# EAGLE schematic west-comms-hardware (EAGLE 9.6.2)
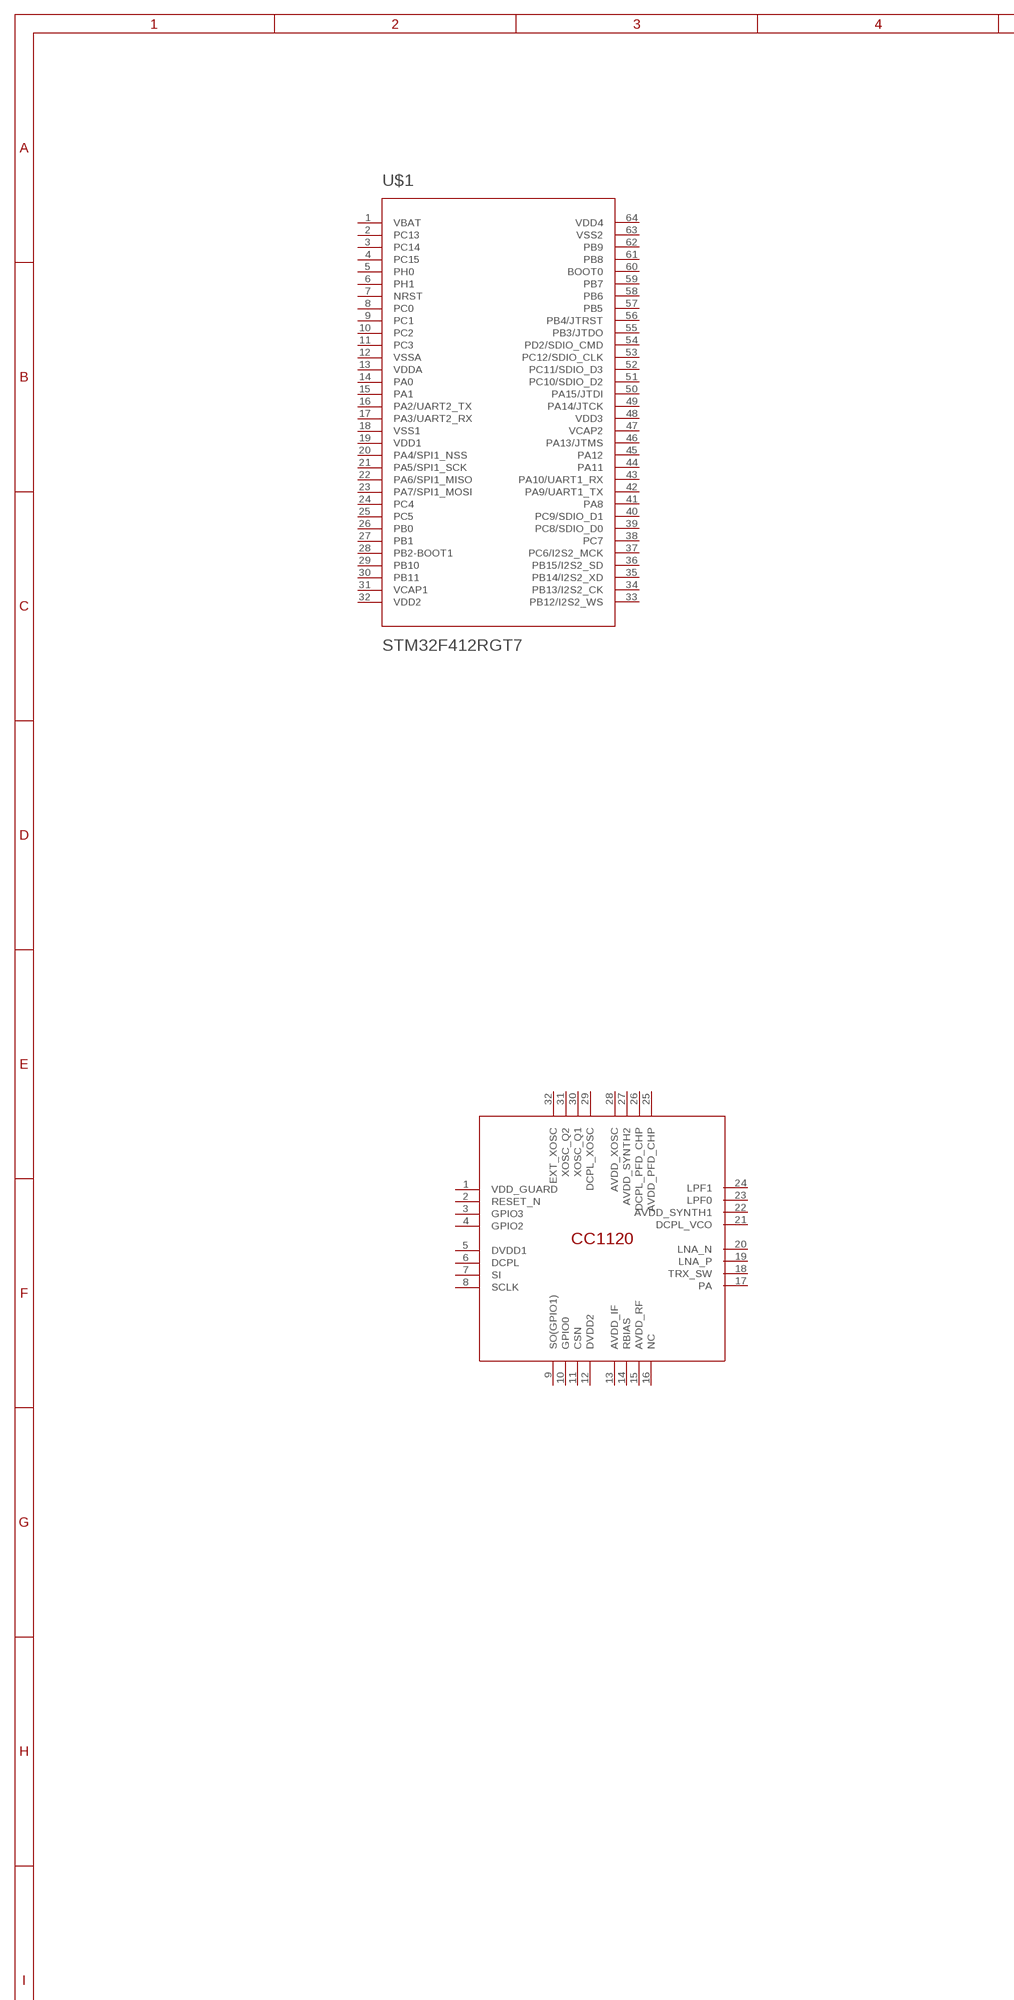
[diagram p0: schematic, sheet 1, part 1 of 2]
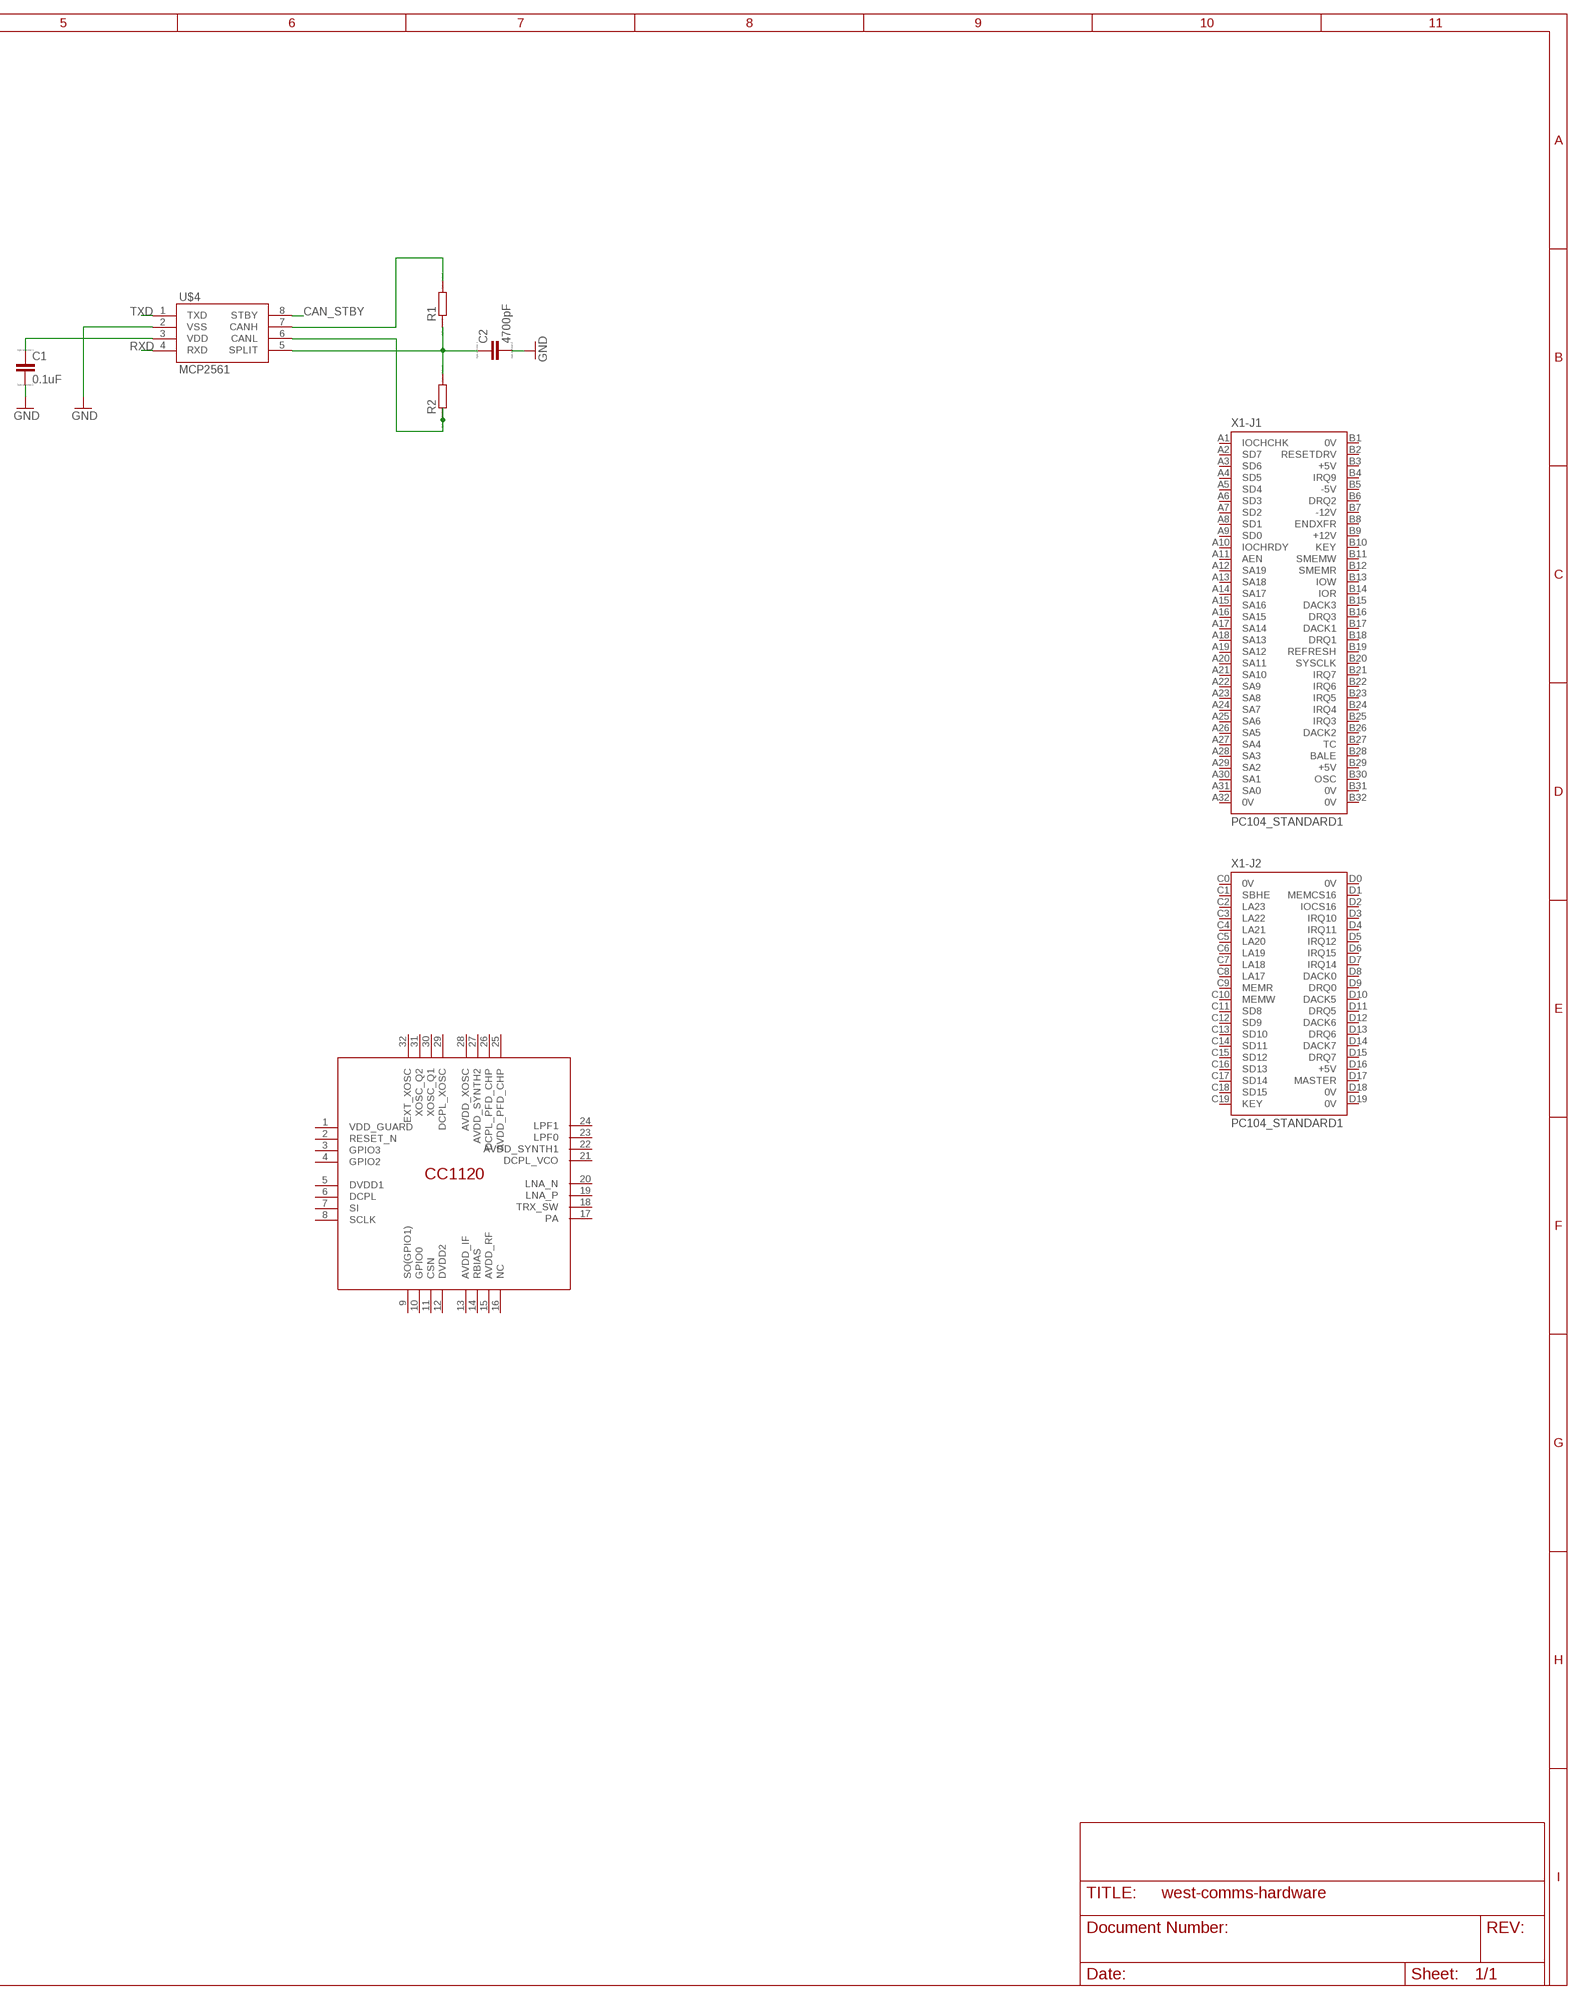
[diagram p1: schematic, sheet 1, part 2 of 2]

## Parts
C1  0.1uF  CC0603  [C0603]
C2  4700pF  CC0603  [C0603]
R1  RR0603  [R0603]
R2  RR0603  [R0603]
U$1  STM32F412RGT7  STM32F405RG  [TQFP64]
U$2  CC1120  [VQFN]
U$3  CC1120  [VQFN]
U$4  MCP2561  [SO08]
X1  PC104_STANDARD1  [PC104-STANDARD]

## Nets
CAN_STBY: U$4.8(STBY)
CANH: R1.2 U$4.7(CANH)
CANL: R2.1 U$4.6(CANL)
GND: C1.2 C2.2 U$4.2(VSS)
N$1: C2.1 R1.1 R2.2 U$4.5(SPLIT)
N$5: C1.1 U$4.3(VDD)
RXD: U$4.4(RXD)
TXD: U$4.1(TXD)
Unconnected: U$1.1(VBAT) U$1.2(PC13) U$1.3(PC14) U$1.4(PC15) U$1.5(PH0) U$1.6(PH1) U$1.7(NRST) U$1.8(PC0) U$1.9(PC1) U$1.10(PC2) U$1.11(PC3) U$1.12(VSSA) U$1.13(VDDA) U$1.14(PA0) U$1.15(PA1) U$1.16(PA2/UART2_TX) U$1.17(PA3/UART2_RX) U$1.18(VSS1) U$1.19(VDD1) U$1.20(PA4/SPI1_NSS) U$1.21(PA5/SPI1_SCK) U$1.22(PA6/SPI1_MISO) U$1.23(PA7/SPI1_MOSI) U$1.24(PC4) U$1.25(PC5) U$1.26(PB0) U$1.27(PB1) U$1.28(PB2-BOOT1) U$1.29(PB10) U$1.30(PB11) U$1.31(VCAP1) U$1.32(VDD2) U$1.33(PB12/I2S2_WS) U$1.34(PB13/I2S2_CK) U$1.35(PB14/I2S2_XD) U$1.36(PB15/I2S2_SD) U$1.37(PC6/I2S2_MCK) U$1.38(PC7) U$1.39(PC8/SDIO_D0) U$1.40(PC9/SDIO_D1) U$1.41(PA8) U$1.42(PA9/UART1_TX) U$1.43(PA10/UART1_RX) U$1.44(PA11) U$1.45(PA12) U$1.46(PA13/JTMS) U$1.47(VCAP2) U$1.48(VDD3) U$1.49(PA14/JTCK) U$1.50(PA15/JTDI) U$1.51(PC10/SDIO_D2) U$1.52(PC11/SDIO_D3) U$1.53(PC12/SDIO_CLK) U$1.54(PD2/SDIO_CMD) U$1.55(PB3/JTDO) U$1.56(PB4/JTRST) U$1.57(PB5) U$1.58(PB6) U$1.59(PB7) U$1.60(BOOT0) U$1.61(PB8) U$1.62(PB9) U$1.63(VSS2) U$1.64(VDD4) U$2.1(VDD_GUARD) U$2.2(RESET_N) U$2.3(GPIO3) U$2.4(GPIO2) U$2.5(DVDD1) U$2.6(DCPL) U$2.7(SI) U$2.8(SCLK) U$2.9(SO(GPIO1)) U$2.10(GPIO0) U$2.11(CSN) U$2.12(DVDD2) U$2.13(AVDD_IF) U$2.14(RBIAS) U$2.15(AVDD_RF) U$2.16(NC) U$2.17(PA) U$2.18(TRX_SW) U$2.19(LNA_P) U$2.20(LNA_N) U$2.21(DCPL_VCO) U$2.22(AVDD_SYNTH1) U$2.23(LPF0) U$2.24(LPF1) U$2.25(AVDD_PFD_CHP) U$2.26(DCPL_PFD_CHP) U$2.27(AVDD_SYNTH2) U$2.28(AVDD_XOSC) U$2.29(DCPL_XOSC) U$2.30(XOSC_Q1) U$2.31(XOSC_Q2) U$2.32(EXT_XOSC) U$3.1(VDD_GUARD) U$3.2(RESET_N) U$3.3(GPIO3) U$3.4(GPIO2) U$3.5(DVDD1) U$3.6(DCPL) U$3.7(SI) U$3.8(SCLK) U$3.9(SO(GPIO1)) U$3.10(GPIO0) U$3.11(CSN) U$3.12(DVDD2) U$3.13(AVDD_IF) U$3.14(RBIAS) U$3.15(AVDD_RF) U$3.16(NC) U$3.17(PA) U$3.18(TRX_SW) U$3.19(LNA_P) U$3.20(LNA_N) U$3.21(DCPL_VCO) U$3.22(AVDD_SYNTH1) U$3.23(LPF0) U$3.24(LPF1) U$3.25(AVDD_PFD_CHP) U$3.26(DCPL_PFD_CHP) U$3.27(AVDD_SYNTH2) U$3.28(AVDD_XOSC) U$3.29(DCPL_XOSC) U$3.30(XOSC_Q1) U$3.31(XOSC_Q2) U$3.32(EXT_XOSC) X1.A1(-J1:IOCHCHK) X1.A2(-J1:SD7) X1.A3(-J1:SD6) X1.A4(-J1:SD5) X1.A5(-J1:SD4) X1.A6(-J1:SD3) X1.A7(-J1:SD2) X1.A8(-J1:SD1) X1.A9(-J1:SD0) X1.A10(-J1:IOCHRDY) X1.A11(-J1:AEN) X1.A12(-J1:SA19) X1.A13(-J1:SA18) X1.A14(-J1:SA17) X1.A15(-J1:SA16) X1.A16(-J1:SA15) X1.A17(-J1:SA14) X1.A18(-J1:SA13) X1.A19(-J1:SA12) X1.A20(-J1:SA11) X1.A21(-J1:SA10) X1.A22(-J1:SA9) X1.A23(-J1:SA8) X1.A24(-J1:SA7) X1.A25(-J1:SA6) X1.A26(-J1:SA5) X1.A27(-J1:SA4) X1.A28(-J1:SA3) X1.A29(-J1:SA2) X1.A30(-J1:SA1) X1.A31(-J1:SA0) X1.A32(-J1:0V) X1.B1(-J1:0V) X1.B2(-J1:RESETDRV) X1.B3(-J1:+5V) X1.B4(-J1:IRQ9) X1.B5(-J1:-5V) X1.B6(-J1:DRQ2) X1.B7(-J1:-12V) X1.B8(-J1:ENDXFR) X1.B9(-J1:+12V) X1.B10(-J1:KEY) X1.B11(-J1:SMEMW) X1.B12(-J1:SMEMR) X1.B13(-J1:IOW) X1.B14(-J1:IOR) X1.B15(-J1:DACK3) X1.B16(-J1:DRQ3) X1.B17(-J1:DACK1) X1.B18(-J1:DRQ1) X1.B19(-J1:REFRESH) X1.B20(-J1:SYSCLK) X1.B21(-J1:IRQ7) X1.B22(-J1:IRQ6) X1.B23(-J1:IRQ5) X1.B24(-J1:IRQ4) X1.B25(-J1:IRQ3) X1.B26(-J1:DACK2) X1.B27(-J1:TC) X1.B28(-J1:BALE) X1.B29(-J1:+5V) X1.B30(-J1:OSC) X1.B31(-J1:0V) X1.B32(-J1:0V) X1.C0(-J2:0V) X1.C1(-J2:SBHE) X1.C2(-J2:LA23) X1.C3(-J2:LA22) X1.C4(-J2:LA21) X1.C5(-J2:LA20) X1.C6(-J2:LA19) X1.C7(-J2:LA18) X1.C8(-J2:LA17) X1.C9(-J2:MEMR) X1.C10(-J2:MEMW) X1.C11(-J2:SD8) X1.C12(-J2:SD9) X1.C13(-J2:SD10) X1.C14(-J2:SD11) X1.C15(-J2:SD12) X1.C16(-J2:SD13) X1.C17(-J2:SD14) X1.C18(-J2:SD15) X1.C19(-J2:KEY) X1.D0(-J2:0V) X1.D1(-J2:MEMCS16) X1.D2(-J2:IOCS16) X1.D3(-J2:IRQ10) X1.D4(-J2:IRQ11) X1.D5(-J2:IRQ12) X1.D6(-J2:IRQ15) X1.D7(-J2:IRQ14) X1.D8(-J2:DACK0) X1.D9(-J2:DRQ0) X1.D10(-J2:DACK5) X1.D11(-J2:DRQ5) X1.D12(-J2:DACK6) X1.D13(-J2:DRQ6) X1.D14(-J2:DACK7) X1.D15(-J2:DRQ7) X1.D16(-J2:+5V) X1.D17(-J2:MASTER) X1.D18(-J2:0V) X1.D19(-J2:0V) X1.GND@1 X1.GND@2 X1.GND@3 X1.GND@4

## Library data of the parts
C1 C2 = eagle-ltspice:C: CAPACITOR, European symbol; SPICEMODEL: NONE; SPICEPREFIX: C
R1 R2 = eagle-ltspice:R: RESISTOR, European symbol; SPICEMODEL: NONE; SPICEPREFIX: R
U$1 = SparkFun-IC-Microcontroller:STM32F405RG: STM32F405RGT6 ARM DSP Chip used on the WAV Trigger board. IC MCU 32BIT 1MB FLASH 64LQFP Datasheet <https://cdn.sparkfun.com/datasheets/Widgets/STM32F405RGT6.pdf> SparkFun Products WAV Trigger <https://www.sparkfun.com/products/13660> (WIG-13660); PROD_ID: IC-11709; VALUE: STM32F405RGT6
U$2 U$3 = west-eagle-library:CC1120: CC1120 High-Performance RF Transceiver for Narrowband Systems <https://www.ti.com/lit/ds/symlink/cc1120.pdf>
U$4 = west-eagle-library:MCP2561: MCP2561/2 High-Speed CAN Transeiver <https://ww1.microchip.com/downloads/en/DeviceDoc/20005167C.pdf>
X1 = con-pc104:PC104_STANDARD: PC/104 Standard 16 bit